# EAGLE design R3-URC18-4-006-001 (EAGLE 8.3.2)
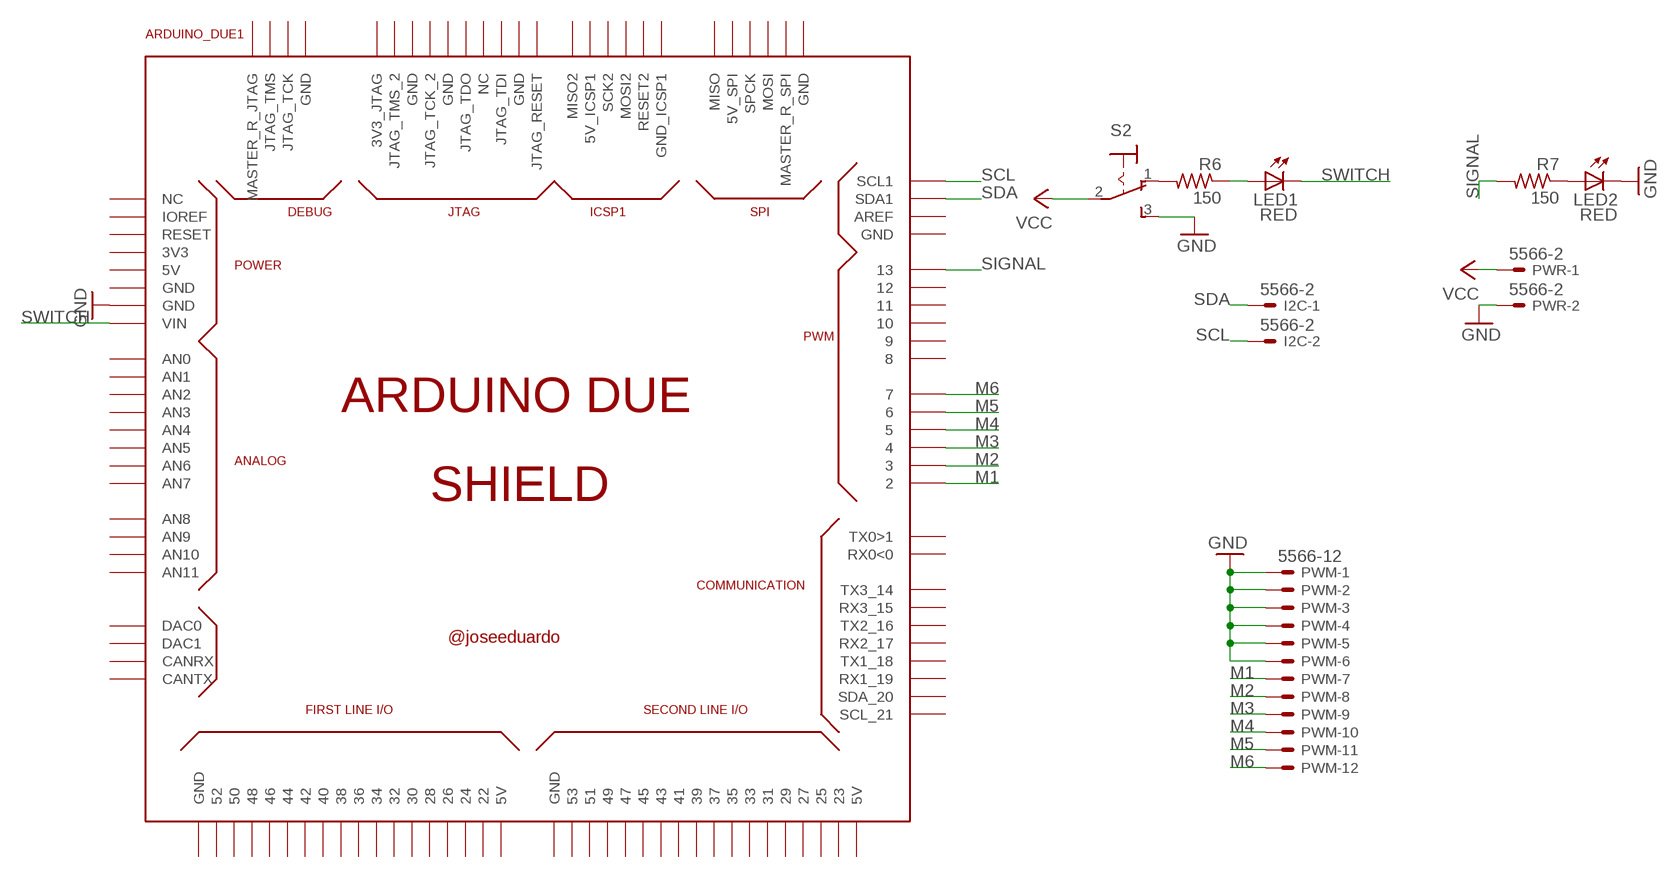
[diagram p0: schematic, sheet 1]

## Parts
ARDUINO_DUE1  ARDUINO_DUE_SHIELD  [ARDUINO_DUE_SHIELD]
I2C  5566-2  [5566-2]
LED1  RED  LED5MM  [LED5MM]
LED2  RED  LED5MM  [LED5MM]
PWM  5566-12  [5566-12]
PWR  5566-2  [5566-2]
R6  150  R-US_0207/10  [0207/10]
R7  150  R-US_0207/10  [0207/10]
S2  M9040P  [M9040P]

## Nets
GND: ARDUINO_DUE1.GND_1(GND) LED2.K(C) PWM.1 PWM.2 PWM.3 PWM.4 PWM.5 PWM.6 PWR.2 S2.3(S)
M1: ARDUINO_DUE1.2 PWM.7
M2: ARDUINO_DUE1.3 PWM.8
M3: ARDUINO_DUE1.4 PWM.9
M4: ARDUINO_DUE1.5 PWM.10
M5: ARDUINO_DUE1.6 PWM.11
M6: ARDUINO_DUE1.7 PWM.12
N$1: R6.2 S2.1(O)
N$2: LED1.A R6.1
N$3: LED2.A R7.1
SCL: ARDUINO_DUE1.SCL1 I2C.2
SDA: ARDUINO_DUE1.SDA1 I2C.1
SIGNAL: ARDUINO_DUE1.13 R7.2
SWITCH: ARDUINO_DUE1.VIN LED1.K(C)
VCC: PWR.1 S2.2(P)
Unconnected: ARDUINO_DUE1.0(RX0<0) ARDUINO_DUE1.1(TX0>1) ARDUINO_DUE1.3V3 ARDUINO_DUE1.3V3_JTAG ARDUINO_DUE1.5V0(5V) ARDUINO_DUE1.5V0_1(5V) ARDUINO_DUE1.5V0_2(5V) ARDUINO_DUE1.5V_2(5V_SPI) ARDUINO_DUE1.5V_ICSP1 ARDUINO_DUE1.8 ARDUINO_DUE1.9 ARDUINO_DUE1.10 ARDUINO_DUE1.11 ARDUINO_DUE1.12 ARDUINO_DUE1.14(TX3_14) ARDUINO_DUE1.15(RX3_15) ARDUINO_DUE1.16(TX2_16) ARDUINO_DUE1.17(RX2_17) ARDUINO_DUE1.18(TX1_18) ARDUINO_DUE1.19(RX1_19) ARDUINO_DUE1.20(SDA_20) ARDUINO_DUE1.21(SCL_21) ARDUINO_DUE1.22 ARDUINO_DUE1.23 ARDUINO_DUE1.24 ARDUINO_DUE1.25 ARDUINO_DUE1.26 ARDUINO_DUE1.27 ARDUINO_DUE1.28 ARDUINO_DUE1.29 ARDUINO_DUE1.30 ARDUINO_DUE1.31 ARDUINO_DUE1.32 ARDUINO_DUE1.33 ARDUINO_DUE1.34 ARDUINO_DUE1.35 ARDUINO_DUE1.36 ARDUINO_DUE1.37 ARDUINO_DUE1.38 ARDUINO_DUE1.39 ARDUINO_DUE1.40 ARDUINO_DUE1.41 ARDUINO_DUE1.42 ARDUINO_DUE1.43 ARDUINO_DUE1.44 ARDUINO_DUE1.45 ARDUINO_DUE1.46 ARDUINO_DUE1.47 ARDUINO_DUE1.48 ARDUINO_DUE1.49 ARDUINO_DUE1.50 ARDUINO_DUE1.51 ARDUINO_DUE1.52 ARDUINO_DUE1.53 ARDUINO_DUE1.A0(AN0) ARDUINO_DUE1.A1(AN1) ARDUINO_DUE1.A2(AN2) ARDUINO_DUE1.A3(AN3) ARDUINO_DUE1.A4(AN4) ARDUINO_DUE1.A5(AN5) ARDUINO_DUE1.A6(AN6) ARDUINO_DUE1.A7(AN7) ARDUINO_DUE1.A8(AN8) ARDUINO_DUE1.A9(AN9) ARDUINO_DUE1.A10(AN10) ARDUINO_DUE1.A11(AN11) ARDUINO_DUE1.AREF ARDUINO_DUE1.CANRX ARDUINO_DUE1.CANTX ARDUINO_DUE1.DAC0 ARDUINO_DUE1.DAC1 ARDUINO_DUE1.GND ARDUINO_DUE1.GND_2(GND) ARDUINO_DUE1.GND_3(GND) ARDUINO_DUE1.GND_4(GND) ARDUINO_DUE1.GND_5(GND) ARDUINO_DUE1.GND_7(GND) ARDUINO_DUE1.GND_8(GND) ARDUINO_DUE1.GND_9(GND) ARDUINO_DUE1.GND_10(GND) ARDUINO_DUE1.GND_ICSP1 ARDUINO_DUE1.IOREF ARDUINO_DUE1.JTAG_RESET ARDUINO_DUE1.JTAG_TCK ARDUINO_DUE1.JTAG_TCK_2 ARDUINO_DUE1.JTAG_TDI ARDUINO_DUE1.JTAG_TDO ARDUINO_DUE1.JTAG_TMS ARDUINO_DUE1.JTAG_TMS_2 ARDUINO_DUE1.MASTER_RESET_JTAG(MASTER_R_JTAG) ARDUINO_DUE1.MASTER_RESET_SPI(MASTER_R_SPI) ARDUINO_DUE1.MISO ARDUINO_DUE1.MISO2 ARDUINO_DUE1.MOSI ARDUINO_DUE1.MOSI2 ARDUINO_DUE1.NC_2(NC) ARDUINO_DUE1.NC_5(NC) ARDUINO_DUE1.RESET ARDUINO_DUE1.RESET2 ARDUINO_DUE1.SCK2 ARDUINO_DUE1.SPCK

## Library data of the parts
ARDUINO_DUE1 = arduino_due_shield:ARDUINO_DUE_SHIELD
I2C PWR = con-molex:5566-2: Mini FIT connector 2 pol Source: http://www.molex.com; OC_FARNELL: 1822072; OC_NEWARK: unknown
LED1 LED2 = led:LED: LED OSRAM: - CHIPLED LG R971, LG N971, LY N971, LG Q971, LY Q971, LO R971, LY R971 LH N974, LH R974 LS Q976, LO Q976, LY Q976 LO Q996 - Hyper CHIPLED LW Q18S LB Q993, LB Q99A, LB R99A - SideLED LS A670, LO A670, LY A670, LG A670, LP A670 LB A673, LV A673, LT A673, LW A673 LH A674 LY A675 LS A676, LA A676, LO A676, LY A676, LW A676 LS A679, LY A679, LG A679 - Hyper Micro SIDELED® LS Y876, LA Y876, LO Y876, LY Y876 LT Y87S - SmartLED LW L88C, LW L88S LB L89C, LB L89S, LG L890 LS L89K, LO L89K, LY L89K LS L896, LA L896, LO L896, LY L896 - TOPLED LS T670, LO T670, LY T670, LG T670, LP T670 LSG T670, LSP T670, LSY T670, LOP T670, LYG T670 LG T671, LOG T671, LSG T671 LB T673, LV T673, LT T673, LW T673 LH T674 LS T676, LA T676, LO T676, LY T676, LB T676, LH T676, LSB T676, LW T676 LB T67C, LV T67C, LT T67C, LS T67K, LO T67K, LY T67K, LW E67C LS E67B, LA E67B, LO E67B, LY E67B, LB E67C, LV E67C, LT E67C LW T67C LS T679, LY T679, LG T679 LS T770, LO T770, LY T770, LG T770, LP T770 LB T773, LV T773, LT T773, LW T773 LH T774 LS E675, LA E675, LY E675, LS T675 LS T776, LA T776, LO T776, LY T776, LB T776 LHGB T686 LT T68C, LB T68C - Hyper Mini TOPLED® LB M676 - Mini TOPLED Santana® LG M470 LS M47K, LO M47K, LY M47K Source: http://www.osram.convergy.de LUXEON: - LUMILED® LXK2-PW12-R00, LXK2-PW12-S00, LXK2-PW14-U00, LXK2-PW14-V00 LXK2-PM12-R00, LXK2-PM12-S00, LXK2-PM14-U00 LXK2-PE12-Q00, LXK2-PE12-R00, LXK2-PE12-S00, LXK2-PE14-T00, LXK2-PE14-U00 LXK2-PB12-K00, LXK2-PB12-L00, LXK2-PB12-M00, LXK2-PB14-N00, LXK2-PB14-P00, LXK2-PB14-Q00 LXK2-PR12-L00, LXK2-PR12-M00, LXK2-PR14-Q00, LXK2-PR14-R00 LXK2-PD12-Q00, LXK2-PD12-R00, LXK2-PD12-S00 LXK2-PH12-R00, LXK2-PH12-S00 LXK2-PL12-P00, LXK2-PL12-Q00, LXK2-PL12-R00 Source: www.luxeon.com KINGBRIGHT: KA-3528ASYC Source: www.kingbright.com
PWM = con-molex:5566-12: Mini FIT connector 12 pol Source: http://www.molex.com; OC_FARNELL: unknown; OC_NEWARK: unknown
R6 R7 = resistor:R-US_: RESISTOR, American symbol
S2 = switch:M9040P: TOGGLE SWITCH Marquardt

## Board
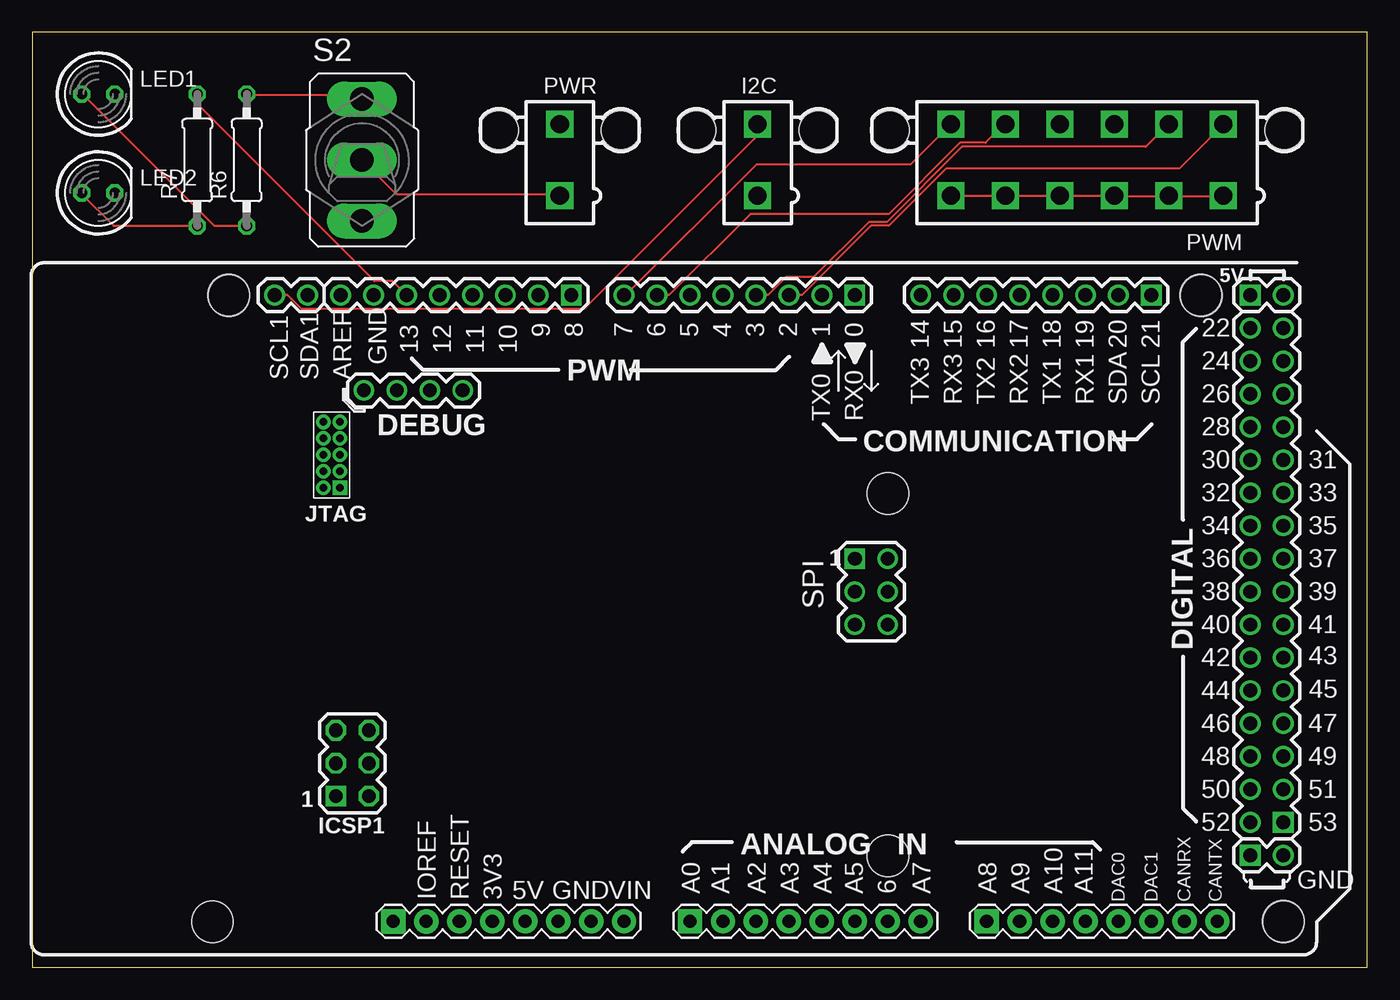
[diagram p1: board, top side]
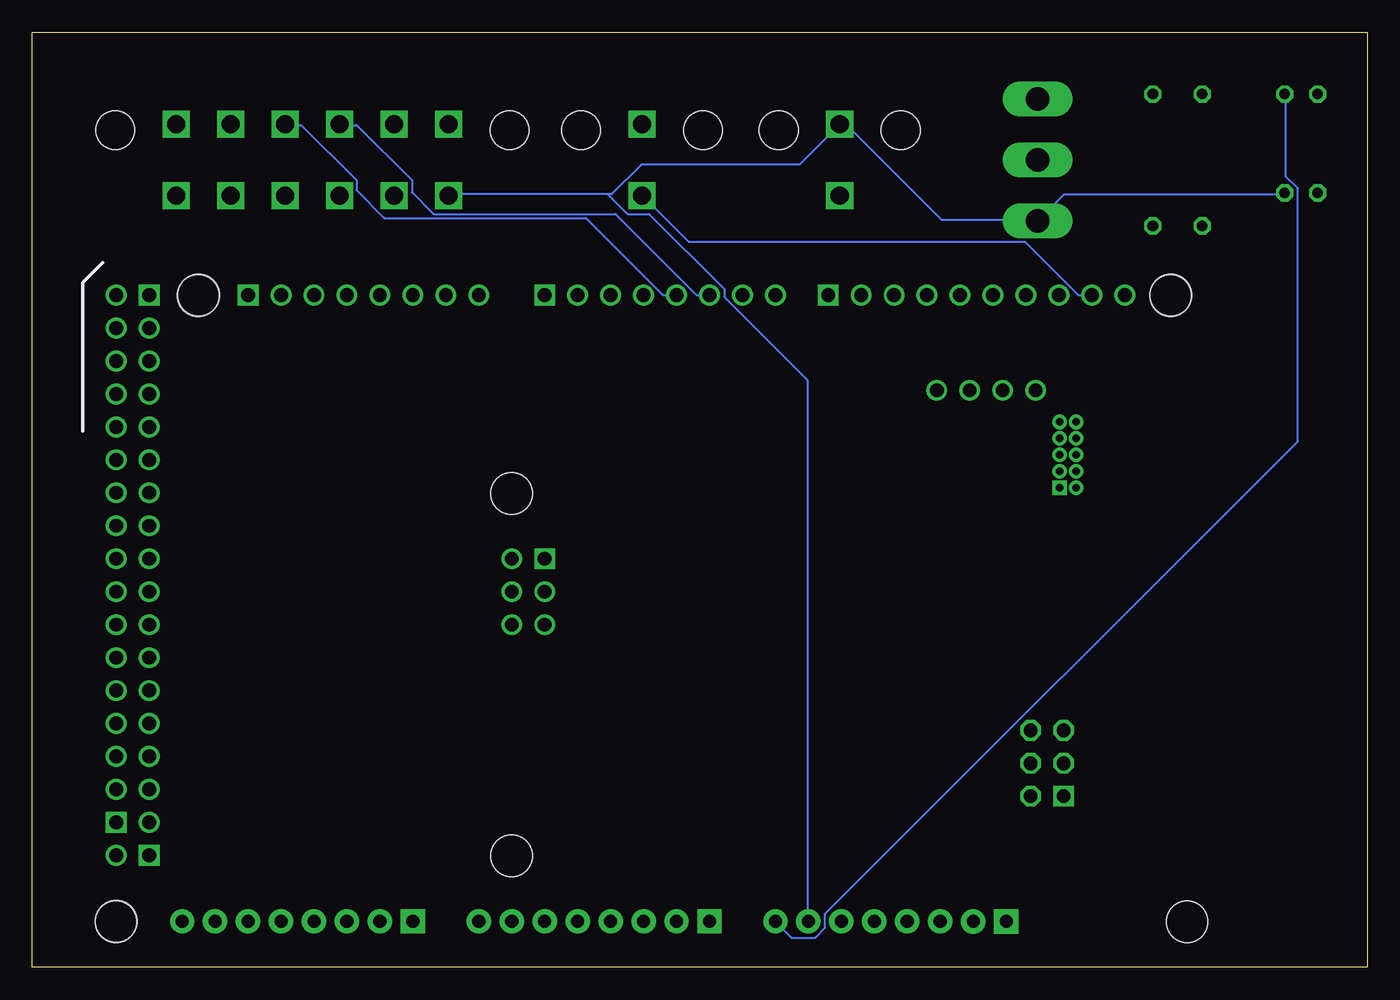
[diagram p2: board, bottom side, seen from below]

Size 102.85 x 72.06 mm. Coordinates in mm from the lower left corner, seen from the top.
Outline: 0,0 102.85,0 102.85,72.06 0,72.06 0,0
Copper layers (1*16): Top 0.035mm / dielectric 1.5mm / Bottom 0.035mm
Design rules "default": minimum track width 6mil, minimum drill 0.35mm, track to track 6mil, track to pad 6mil, pad to pad 6mil, via to via 6mil, smd to smd 6mil, copper to edge 40mil, drill to drill 6mil, minimum pad ring 10mil, minimum via ring 8mil, stop-mask expansion 4mil, vias tented up to drill 0mil, thermal gap 10mil

### Footprints (pad centres in the part's own frame; a part is rotated, then mirrored left to right if it is on the bottom)
ARDUINO_DUE_SHIELD = drill 1.067 square: 0 63.373,51.816; 5V0_1 93.853,51.816; 8 41.529,51.816; 21 86.233,51.816; 53 96.393,11.176; GND_2 93.853,8.636; MISO 63.373,31.496; MISO2 23.384,13.196 | drill 1.067: 1 60.833,51.816; 2 58.293,51.816; 3 55.753,51.816; 4 53.213,51.816; 5 50.673,51.816; 5V0_2 96.393,51.816; 5V_2 65.913,31.496; 6 48.133,51.816; 7 45.593,51.816; 9 38.989,51.816; 10 36.449,51.816; 11 33.909,51.816; 12 31.369,51.816; 13 28.829,51.816; 14 68.453,51.816; 15 70.993,51.816; 16 73.533,51.816; 17 76.073,51.816; 18 78.613,51.816; 19 81.153,51.816; 20 83.693,51.816; 22 93.853,49.276; 23 96.393,49.276; 24 93.853,46.736; 25 96.393,46.736; 26 93.853,44.196; 27 96.393,44.196; 28 93.853,41.656; 29 96.393,41.656; 30 93.853,39.116; 31 96.393,39.116; 32 93.853,36.576; 33 96.393,36.576; 34 93.853,34.036; 35 96.393,34.036; 36 93.853,31.496; 37 96.393,31.496; 38 93.853,28.956; 39 96.393,28.956; 40 93.853,26.416; 41 96.393,26.416; 42 93.853,23.876; 43 96.393,23.876; 44 93.853,21.336; 45 96.393,21.336; 46 93.853,18.796; 47 96.393,18.796; 48 93.853,16.256; 49 96.393,16.256; 50 93.853,13.716; 51 96.393,13.716; 52 93.853,11.176; AREF 23.749,51.816; GND_3 96.393,8.636; GND_4 26.289,51.816; GND_5 65.913,26.416; GND_7 33.161,44.473; JTAG_TCK 30.621,44.473; JTAG_TMS 28.081,44.473; MASTER_RESET_JTAG 25.541,44.473; MASTER_RESET_SPI 63.373,26.416; MOSI 65.913,28.956; SCL1 18.669,51.816; SDA1 21.209,51.816; SPCK 63.373,28.956 | drill 1.016 pad 1.88: 3V3 35.433,3.556; 5V0 37.973,3.556; A1 53.213,3.556; A2 55.753,3.556; A3 58.293,3.556; A4 60.833,3.556; A5 63.373,3.556; A6 65.913,3.556; A7 68.453,3.556; A9 76.073,3.556; A10 78.613,3.556; A11 81.153,3.556; CANRX 88.773,3.556; CANTX 91.313,3.556; DAC0 83.693,3.556; DAC1 86.233,3.556; GND 40.513,3.556; GND_1 43.053,3.556; IOREF 30.346,3.543; RESET 32.893,3.555; VIN 45.593,3.556 | drill 0.6 pad 1.016 square: 3V3_JTAG 23.689,36.964 | drill 1.067 octagon: 5V_ICSP1 25.924,13.196; GND_ICSP1 25.924,18.276; MOSI2 25.924,15.736; RESET2 23.384,18.276; SCK2 23.384,15.736 | drill 1.016 pad 1.88 square: A0 50.673,3.556; A8 73.533,3.556; NC_2 27.806,3.543 | drill 0.6 pad 1.143: GND_8 23.689,38.234; GND_9 23.689,40.774; GND_10 23.689,42.044; JTAG_RESET 22.419,42.044; JTAG_TCK_2 22.419,38.234; JTAG_TDI 22.419,40.774; JTAG_TDO 22.419,39.504; JTAG_TMS_2 22.419,36.964; NC_5 23.689,39.504 | hole 3.2: 15.113,51.816; 90.043,51.816; 96.393,3.556; 96.418,3.505; 15.138,51.765; 90.068,51.765; 13.868,3.505; 65.938,36.525; 65.938,8.585
5566-2 = drill 1.4 square: 1 0,-2.75; 2 0,2.75 | hole 3: 4.7,2.29; -4.7,2.29
LED5MM = drill 0.813 octagon: A -1.27,0; K 1.27,0
5566-12 = drill 1.4 square: 1 10.5,-2.75; 2 6.3,-2.75; 3 2.1,-2.75; 4 -2.1,-2.75; 5 -6.3,-2.75; 6 -10.5,-2.75; 7 10.5,2.75; 8 6.3,2.75; 9 2.1,2.75; 10 -2.1,2.75; 11 -6.3,2.75; 12 -10.5,2.75 | hole 3: 15.2,2.29; -15.2,2.29
0207/10 = drill 0.813 octagon: 1 -5.08,0; 2 5.08,0
M9040P = drill 1.803 long: 1 0,4.699; 2 0,0; 3 0,-4.699

### Placement (x,y rotation side)
ARDUINO_DUE1  0,0 0 top
I2C  55.88,62.23 0 top
LED1  5.08,67.31 0 top
LED2  5.08,59.69 0 top
PWM  81.28,62.23 0 top
PWR  40.64,62.23 0 top
R6  16.51,62.23 90 top
R7  12.7,62.23 90 top
S2  25.4,62.23 0 top

### Tracks (layer width: path | path; a pad name or v marks a point on that pad's centre or on a via)
GND
  Top 0.152: PWM.6 70.87,59.44 74.83,59.44 PWM.5 74.98,59.44 79.1,59.44 PWM.4 79.25,59.44 83.36,59.44 PWM.3 83.52,59.44 87.48,59.44 PWM.2 87.63,59.44 91.75,59.44 PWM.1
  Bottom 0.152: LED2.K 6.4,59.59 23.32,59.59 25.3,57.61 S2.3 25.45,57.61 32.77,57.61 40.08,64.92 40.54,64.92 PWR.2 40.69,64.92 43.74,61.87 55.93,61.87 58.22,59.59 58.52,59.59 | 58.52,59.59 70.71,59.59 PWM.6 | 58.52,59.59 57,58.06 55.32,58.06 49.53,52.27 49.53,51.66 43.13,45.26 43.13,3.66 ARDUINO_DUE1.GND_1
M1
  Top 0.152: ARDUINO_DUE1.2 59.28,51.82 64.62,57.15 65.99,57.15 70.41,61.57 88.39,61.57 91.75,64.92 PWM.7
M2
  Top 0.152: ARDUINO_DUE1.3 56.69,51.82 58.06,53.19 60.2,53.19 64.47,57.45 65.84,57.45 71.63,63.25 85.8,63.25 87.48,64.92 PWM.8
M3
  Bottom 0.152: ARDUINO_DUE1.4 54.25,51.82 60.2,57.76 75.74,57.76 77.88,59.89 77.88,60.66 82.14,64.92 83.36,64.92 PWM.9
M4
  Bottom 0.152: ARDUINO_DUE1.5 51.66,51.82 57.91,58.06 71.93,58.06 73.61,59.74 73.61,60.66 77.88,64.92 79.1,64.92 PWM.10
M5
  Top 0.152: ARDUINO_DUE1.6 49.07,51.82 55.32,58.06 65.99,58.06 71.48,63.55 73.46,63.55 74.83,64.92 PWM.11
M6
  Top 0.152: ARDUINO_DUE1.7 45.72,51.82 55.78,61.87 67.67,61.87 70.71,64.92 PWM.12
N$1
  Top 0.152: R6.2 16.61,67.21 25.15,67.21 25.3,67.06 S2.1
N$2
  Top 0.152: R6.1 14.02,57.15 3.81,67.36 LED1.A
N$3
  Top 0.152: R7.1 6.25,57.15 3.81,59.59 LED2.A
SCL
  Top 0.152: ARDUINO_DUE1.SCL1 19.66,51.82 20.73,50.75 42.52,50.75 55.78,64.01 55.78,64.92 I2C.2
SDA
  Bottom 0.152: ARDUINO_DUE1.SDA1 22.25,51.82 26.36,55.93 52.27,55.93 55.78,59.44 I2C.1
SIGNAL
  Top 0.152: R7.2 12.8,67.21 12.8,66.45 26.36,52.88 27.74,52.88 28.8,51.82 ARDUINO_DUE1.13
SWITCH
  Bottom 0.152: LED1.K 6.25,67.21 6.25,60.96 5.33,60.05 5.33,40.54 41.76,4.12 41.76,3.05 42.52,2.29 44.35,2.29 45.57,3.5 ARDUINO_DUE1.VIN
VCC
  Top 0.152: S2.2 28.04,59.59 40.54,59.59 PWR.1